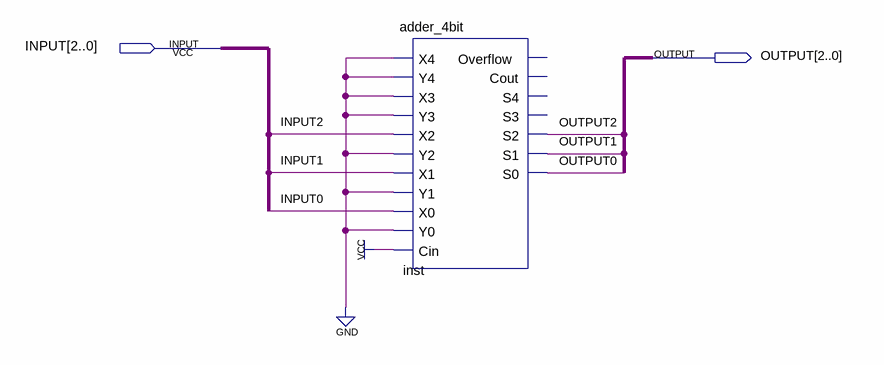
[diagram p0: schematic sheet]
// Quartus schematic bus_plusOne_adder3b.bdf as structural Verilog: 1 symbols, 2 pins
module bus_plusOne_adder3b (
  input  [2:0] INPUT,
  output [2:0] OUTPUT
);

  adder_4bit inst (
    .X4(1'b0), .Y4(1'b0), .X3(1'b0), .Y3(1'b0), .X2(INPUT[2]), .Y2(1'b0), .X1(INPUT[1]), .Y1(1'b0),
    .X0(INPUT[0]), .Y0(1'b0), .Cin(1'b1), .S2(OUTPUT[2]), .S1(OUTPUT[1]), .S0(OUTPUT[0]));  // open: Overflow, Cout, S4, S3
endmodule
